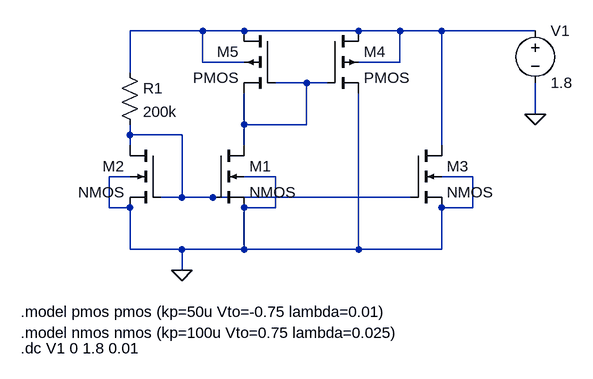
[diagram p0: schematic Current Mirror.asc]
Current Mirror.asc, the LTspice schematic file:
Version 4
SHEET 1 944 680
WIRE 224 -32 112 -32
WIRE 288 -32 224 -32
WIRE 464 -32 288 -32
WIRE 528 -32 464 -32
WIRE 592 -32 528 -32
WIRE 736 -32 592 -32
WIRE 224 16 224 -32
WIRE 288 16 224 16
WIRE 528 16 528 -32
WIRE 528 16 464 16
WIRE 112 32 112 -32
WIRE 384 48 336 48
WIRE 416 48 384 48
WIRE 736 96 736 48
WIRE 288 112 288 64
WIRE 384 112 384 48
WIRE 384 112 288 112
WIRE 112 128 112 112
WIRE 192 128 112 128
WIRE 112 144 112 128
WIRE 288 144 288 112
WIRE 592 144 592 -32
WIRE 112 192 80 192
WIRE 336 192 288 192
WIRE 640 192 592 192
WIRE 192 224 192 128
WIRE 192 224 160 224
WIRE 240 224 192 224
WIRE 544 224 240 224
WIRE 80 240 80 192
WIRE 112 240 80 240
WIRE 336 240 336 192
WIRE 336 240 288 240
WIRE 640 240 640 192
WIRE 640 240 592 240
WIRE 112 304 112 240
WIRE 192 304 112 304
WIRE 288 304 288 240
WIRE 288 304 192 304
WIRE 464 304 464 64
WIRE 464 304 288 304
WIRE 592 304 592 240
WIRE 592 304 464 304
WIRE 192 336 192 304
FLAG 192 336 0
FLAG 736 96 0
SYMBOL nmos4 240 144 R0
SYMATTR InstName M1
SYMATTR Value2 l=1u w=10u
SYMBOL nmos4 160 144 M0
SYMATTR InstName M2
SYMATTR Value2 l=1u w=10u
SYMBOL res 96 16 R0
SYMATTR InstName R1
SYMATTR Value 200k
SYMBOL voltage 736 -48 R0
WINDOW 123 0 0 Left 0
WINDOW 39 0 0 Left 0
SYMATTR InstName V1
SYMATTR Value 1.8
SYMBOL nmos4 544 144 R0
SYMATTR InstName M3
SYMATTR Value2 l=1u w=10u
SYMBOL pmos4 416 -32 R0
SYMATTR InstName M4
SYMATTR Value2 l=1u w=30u
SYMBOL pmos4 336 -32 M0
SYMATTR InstName M5
SYMATTR Value2 l=1u w=30u
TEXT -56 432 Left 2 !.model nmos nmos (kp=100u Vto=0.75 lambda=0.025)
TEXT -56 456 Left 2 !.dc V1 0 1.8 0.01
TEXT -56 400 Left 2 !.model pmos pmos (kp=50u Vto=-0.75 lambda=0.01)

The netlist it stands for:
* Current Mirror.asc
M1 N002 N003 0 0 NMOS l=1u w=10u
M2 N003 N003 0 0 NMOS l=1u w=10u
R1 N001 N003 200k
V1 N001 0 1.8
M3 N001 N003 0 0 NMOS l=1u w=10u
M4 N001 N002 0 N001 PMOS l=1u w=30u
M5 N001 N002 N002 N001 PMOS l=1u w=30u
.model NMOS NMOS
.model PMOS PMOS
.lib standard.mos
.model nmos nmos (kp=100u Vto=0.75 lambda=0.025)
.dc V1 0 1.8 0.01
.model pmos pmos (kp=50u Vto=-0.75 lambda=0.01)
.backanno
.end